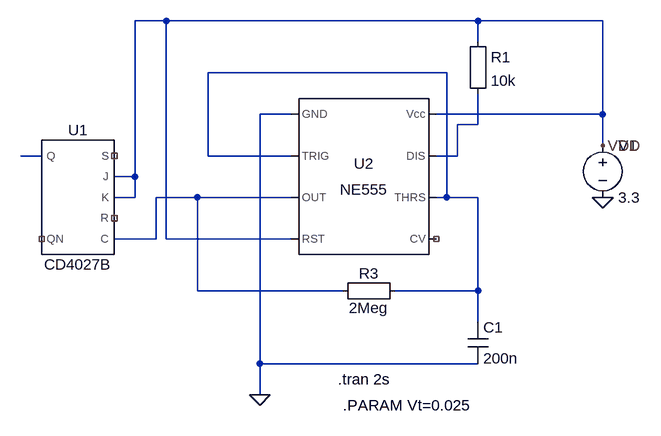
[diagram p0: schematic FrequencyGenerator.asc]
FrequencyGenerator.asc, the LTspice schematic file:
Version 4
SHEET 1 940 712
WIRE -160 64 -208 64
WIRE 320 64 -160 64
WIRE 512 64 320 64
WIRE 320 96 320 64
WIRE 272 144 -96 144
WIRE 32 208 -16 208
WIRE 512 208 512 64
WIRE 512 208 256 208
WIRE 320 224 320 176
WIRE 320 224 288 224
WIRE 512 256 512 208
WIRE -352 272 -384 272
WIRE -96 272 -96 144
WIRE 32 272 -96 272
WIRE 288 272 288 224
WIRE 288 272 256 272
WIRE -208 304 -208 64
WIRE -208 304 -240 304
WIRE -208 336 -208 304
WIRE -208 336 -240 336
WIRE -112 336 -176 336
WIRE 32 336 -112 336
WIRE 272 336 272 144
WIRE 272 336 256 336
WIRE 320 336 272 336
WIRE -176 400 -176 336
WIRE -176 400 -240 400
WIRE -160 400 -160 64
WIRE 32 400 -160 400
WIRE -112 480 -112 336
WIRE 112 480 -112 480
WIRE 320 480 320 336
WIRE 320 480 192 480
WIRE 320 528 320 480
WIRE -16 592 -16 208
WIRE 320 592 -16 592
WIRE -16 640 -16 592
FLAG 512 336 0
FLAG 512 256 VDD
FLAG -16 640 0
SYMBOL voltage 512 240 R0
SYMATTR InstName V1
SYMATTR Value 3.3
SYMBOL Misc/NE555 144 304 R0
SYMATTR InstName U2
SYMBOL Misc/EuropeanResistor 208 464 R90
WINDOW 0 5 56 VBottom 2
WINDOW 3 27 56 VTop 2
SYMATTR InstName R3
SYMATTR Value 2Meg
SYMBOL Misc/EuropeanResistor 304 80 R0
SYMATTR InstName R1
SYMATTR Value 10k
SYMBOL cap 304 528 R0
SYMATTR InstName C1
SYMATTR Value 200n
SYMBOL CD4027B -288 336 M0
SYMATTR InstName U1
TEXT 104 616 Left 2 !.tran 2s
TEXT 112 656 Left 2 !.PARAM Vt=0.025

The netlist it stands for:
* FrequencyGenerator.asc
V1 VDD 0 3.3
XU2 0 N001 N004 VDD NC_01 N001 N002 VDD NE555  ; pins GND TRIG OUT RST CV THRS DIS Vcc
R3 N001 N004 2Meg
R1 VDD N002 10k
C1 N001 0 200n
XU1 NC_02 VDD N004 VDD NC_03 N003 NC_04 VDD 0 CD4027B VDD=3.3 SPEED=0.1 TRIPDT=1e-9  ; pins S J C K R Q QN
.tran 2s
.PARAM Vt=0.025
.lib NE555.sub
.lib CD4000_v.lib
.backanno
.end